# EAGLE design D1MiniTerminalBoard2Sided (EAGLE 7.6.0)
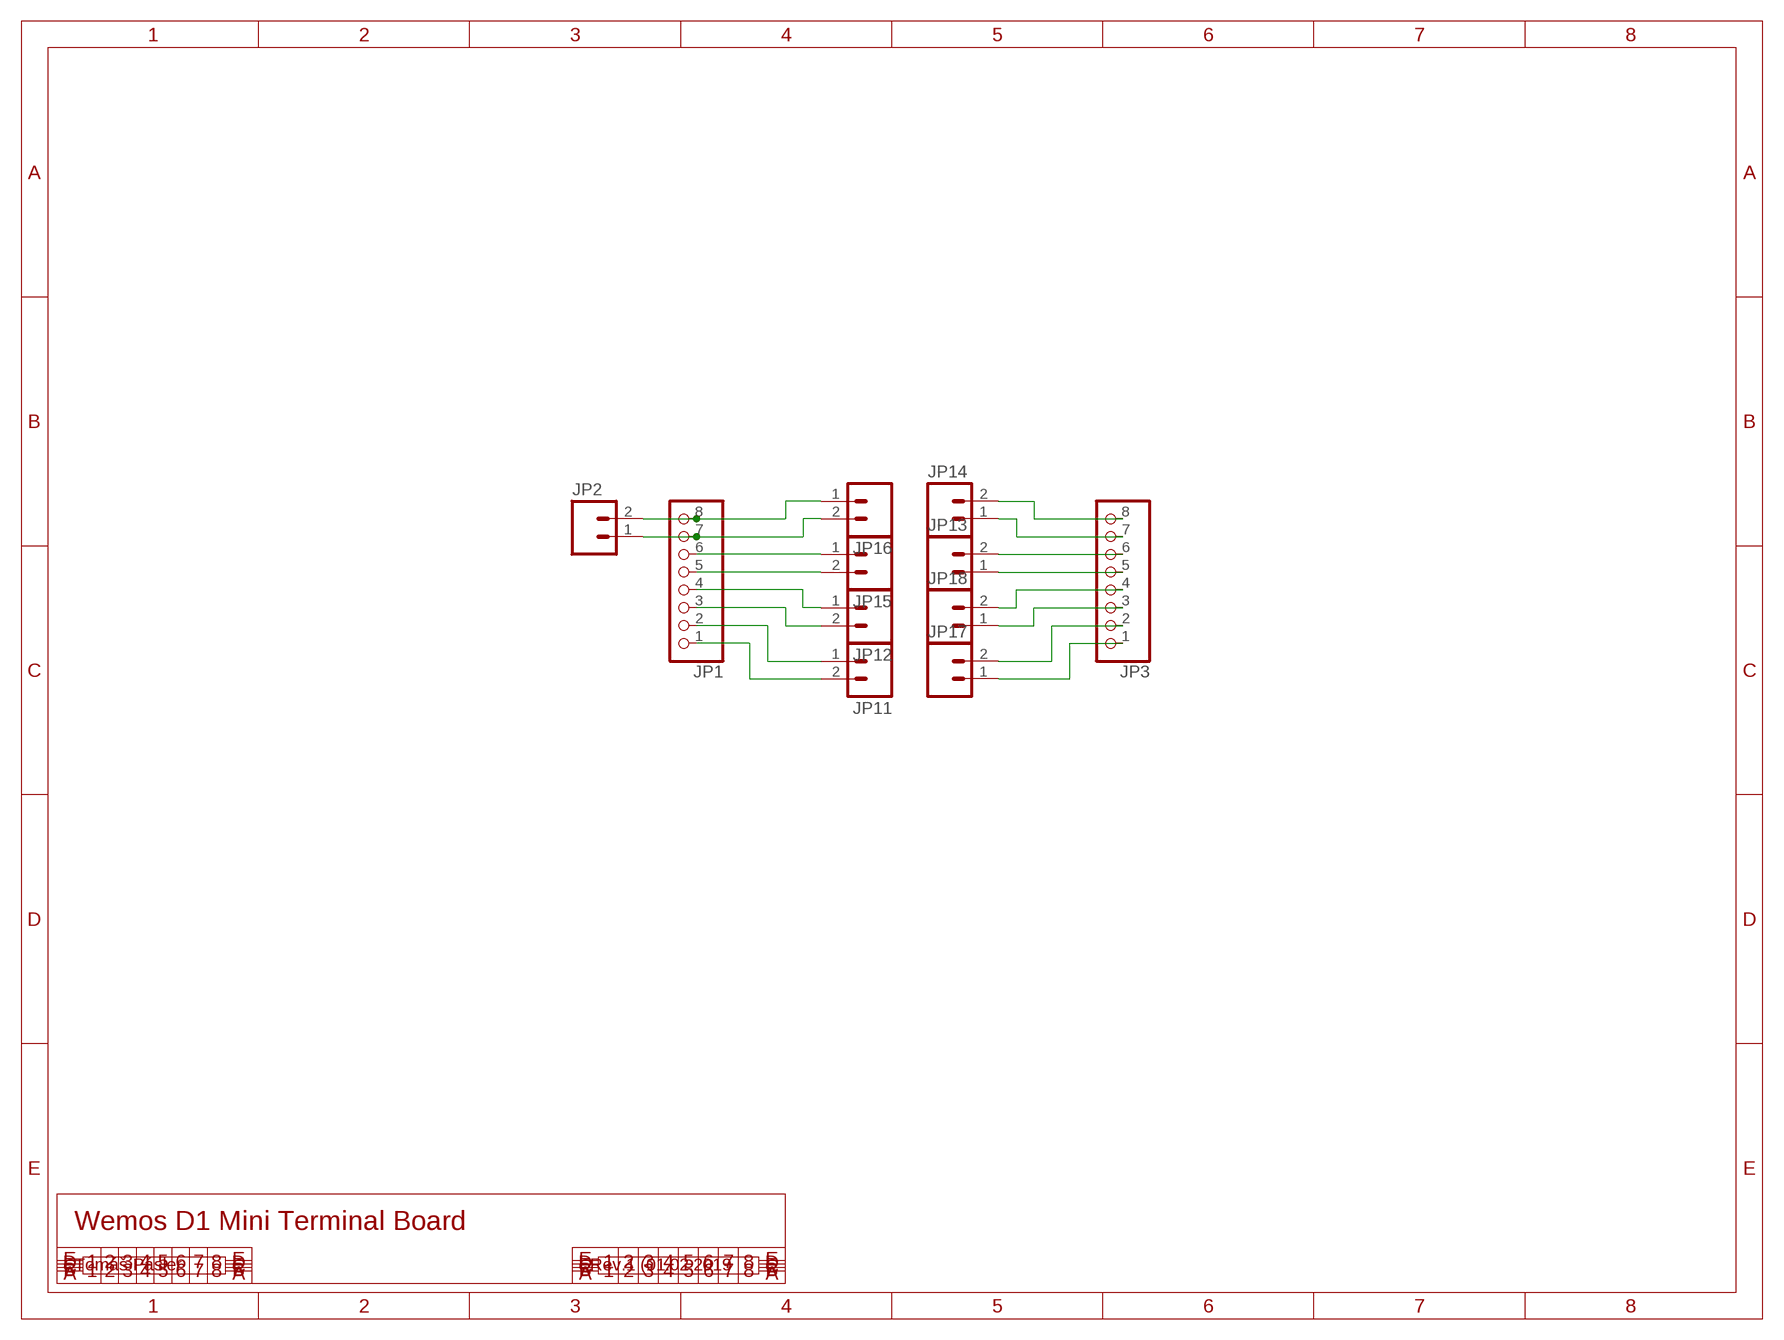
[diagram p0: schematic, sheet 1]

## Parts
JP1  PINHD-1X8  [1X08]
JP2  M023.5MM  [SCREWTERMINAL-3.5MM-2]
JP3  PINHD-1X8  [1X08]
JP11  M023.5MM  [SCREWTERMINAL-3.5MM-2]
JP12  M023.5MM  [SCREWTERMINAL-3.5MM-2]
JP13  M023.5MM  [SCREWTERMINAL-3.5MM-2]
JP14  M023.5MM  [SCREWTERMINAL-3.5MM-2]
JP15  M023.5MM  [SCREWTERMINAL-3.5MM-2]
JP16  M023.5MM  [SCREWTERMINAL-3.5MM-2]
JP17  M023.5MM  [SCREWTERMINAL-3.5MM-2]
JP18  M023.5MM  [SCREWTERMINAL-3.5MM-2]

## Nets
N$28: JP1.8 JP2.2 JP16.1
N$29: JP1.7 JP2.1 JP16.2
N$30: JP1.1 JP11.2
N$31: JP1.2 JP11.1
N$32: JP1.3 JP12.2
N$33: JP1.4 JP12.1
N$34: JP1.5 JP15.2
N$35: JP1.6 JP15.1
N$36: JP3.4 JP18.2
N$37: JP3.3 JP18.1
N$38: JP3.8 JP14.2
N$39: JP3.7 JP14.1
N$40: JP3.6 JP13.2
N$41: JP3.5 JP13.1
N$42: JP3.2 JP17.2
N$43: JP3.1 JP17.1

## Notes on the sheet
- Wemos D1 Mini Terminal Board
- Tomáš Pásler | Rev.1 (01.02.2019

## Library data of the parts
JP1 JP3 = pinhead:PINHD-1X8: PIN HEADER
JP2 JP11-JP18 = freetronics-jon:M02: Header 2 Standard 2-pin 0.1" header. Use with straight break away headers (SKU : PRT-00116), right angle break away headers (PRT-00553), swiss pins (PRT-00743), machine pins (PRT-00117), and female headers (PRT-00115). Molex polarized connector foot print use with SKU : PRT-08233 with associated crimp pins and housings.

## Net classes
0 default: width 0.203 mm, drill 0.356 mm, clearance 0.152 mm
1 power: width 0.203 mm, clearance 0.152 mm

## Board
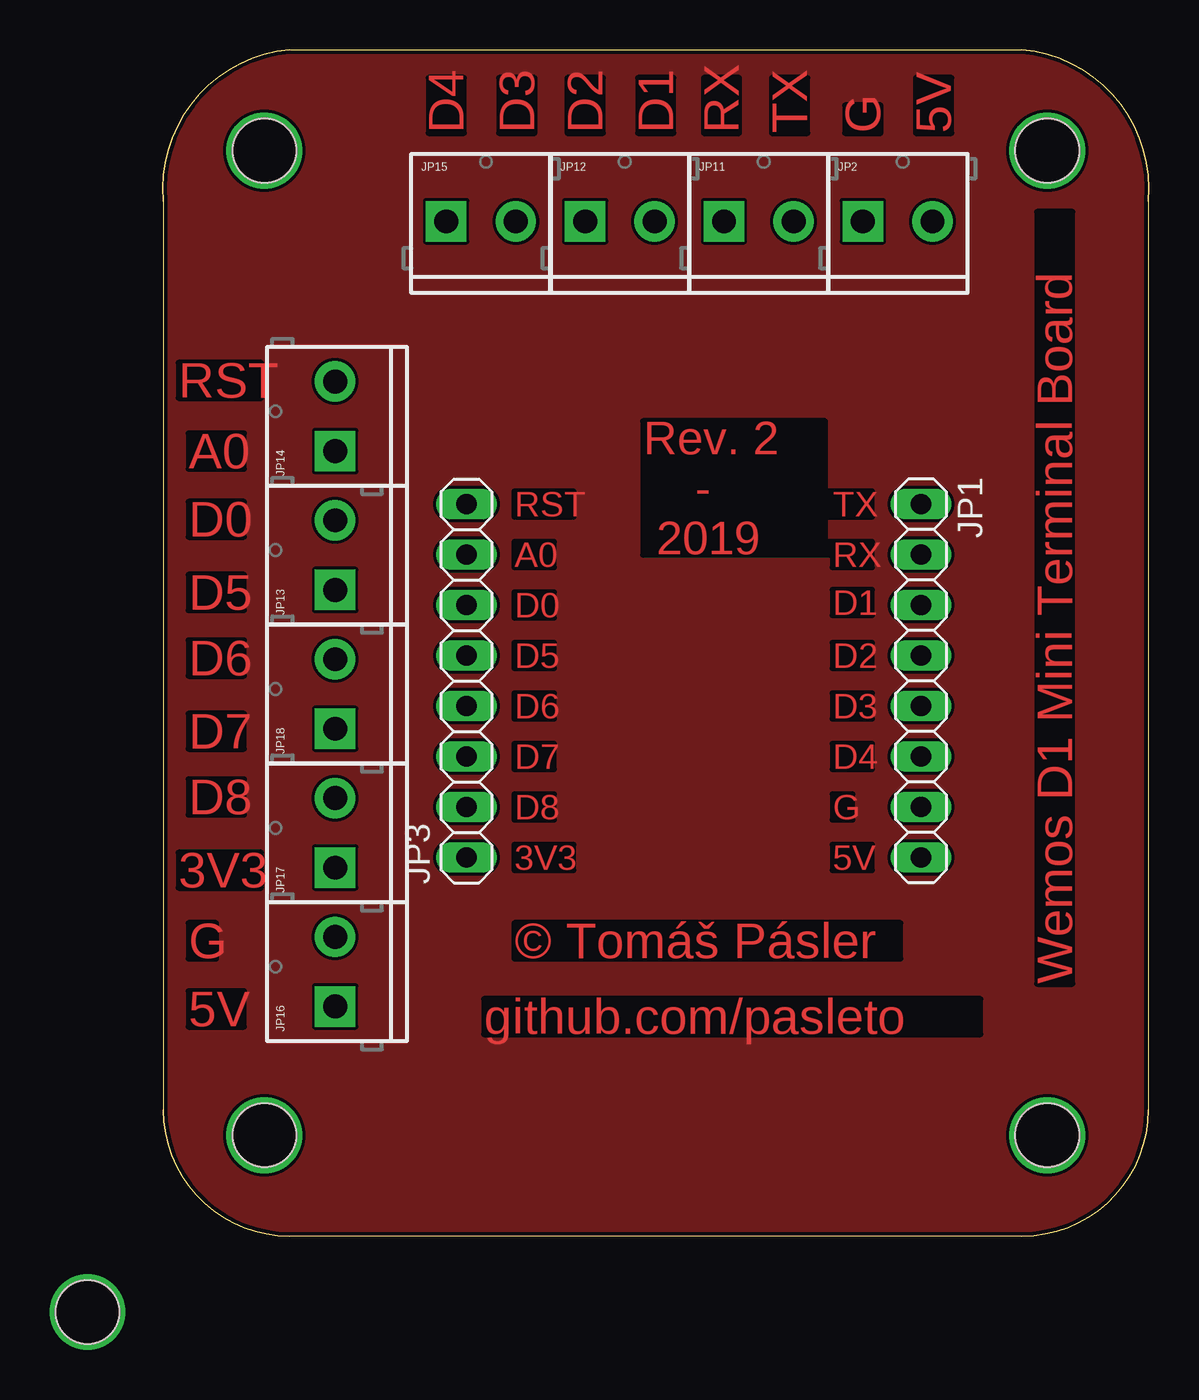
[diagram p1: board, top side]
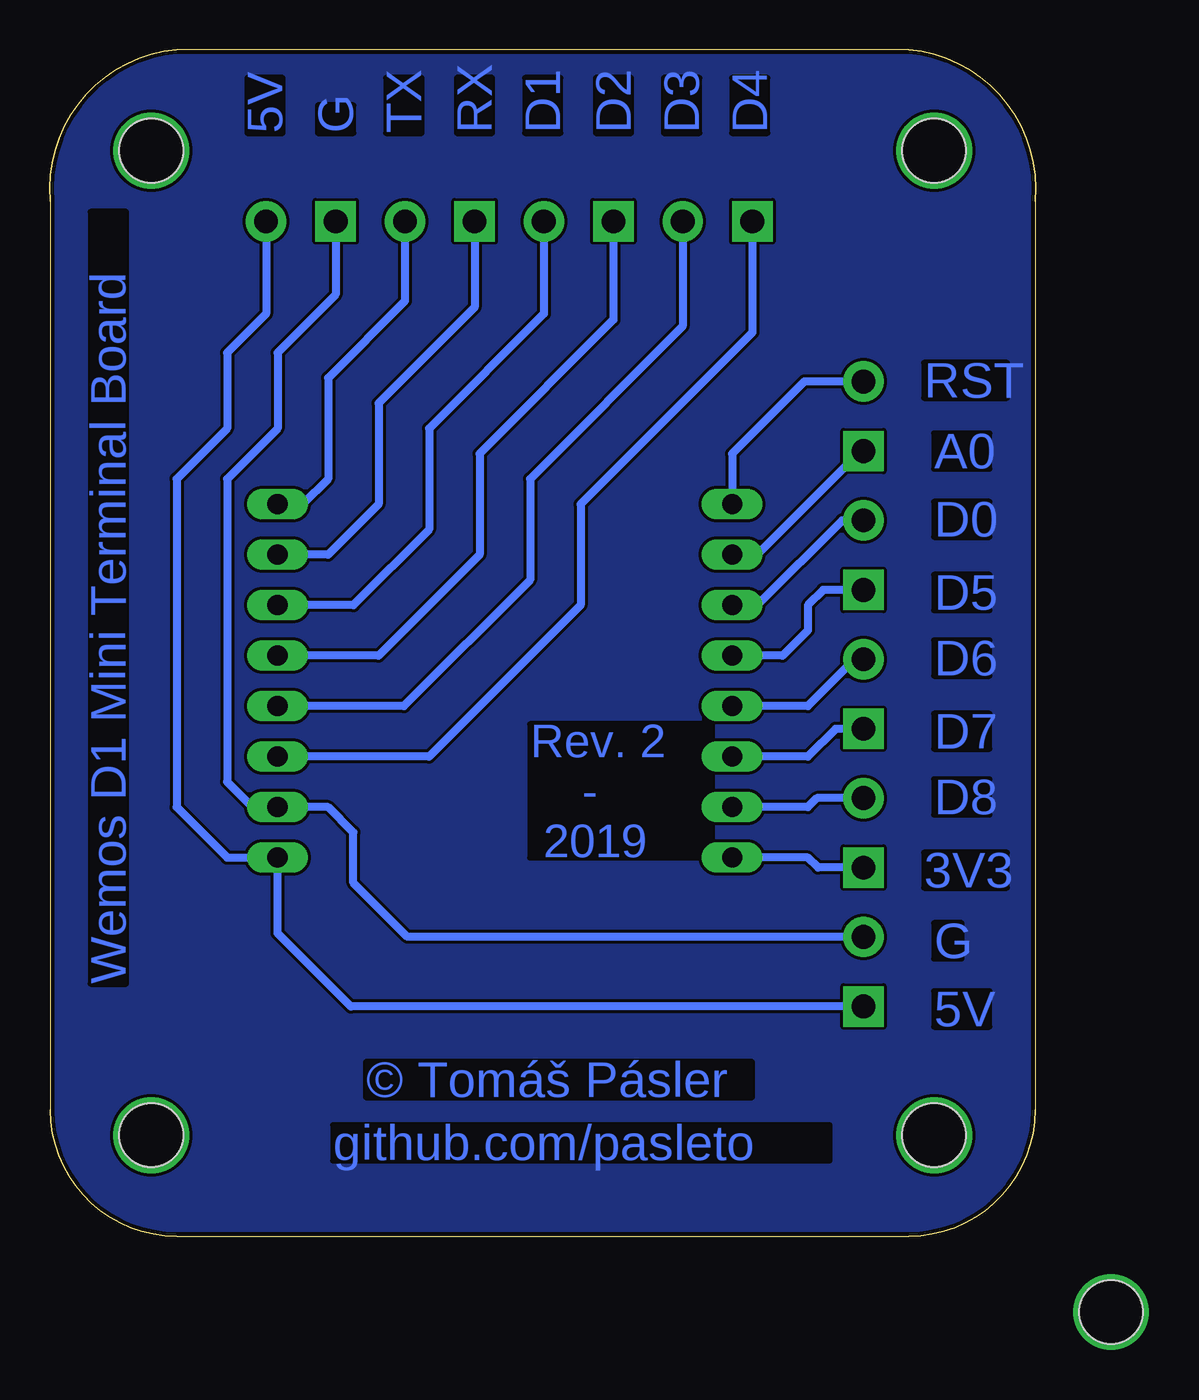
[diagram p2: board, bottom side, seen from below]

Size 49.59 x 59.69 mm. Coordinates in mm from the lower left corner, seen from the top.
Outline: 49.56,52.07 arc90 43.21,59.69
Outline: 6.38,59.69 arc90 0.03,52.07
Outline: 43.21,0 arc90 49.56,6.35
Outline: 0.03,6.35 arc90 6.38,0
Outline: 0.03,52.07 arc-90 6.38,59.69
Outline: 43.21,59.69 arc-90 49.56,52.07
Outline: 6.38,0 arc-90 0.03,6.35
Outline: 49.56,6.35 arc-90 43.21,0
Outline: 43.21,0 6.38,0
Outline: 49.56,52.07 arc90 43.21,59.69
Outline: 6.38,59.69 arc90 0.03,52.07
Outline: 43.21,0 arc90 49.56,6.35
Outline: 0.03,6.35 arc90 6.38,0
Outline: 49.56,52.07 49.56,6.35
Outline: 6.38,59.69 43.21,59.69
Outline: 0.03,52.07 0.03,6.35
Outline: 0.03,52.07 arc-90 6.38,59.69
Outline: 43.21,59.69 arc-90 49.56,52.07
Outline: 6.38,0 arc-90 0.03,6.35
Outline: 49.56,6.35 arc-90 43.21,0
Copper layers (1*16): Top 0.035mm / dielectric 1.5mm / Bottom 0.035mm
Design rules "ElectroDragon_2layer_DRU_no_angle_20140221": minimum track width 6mil, minimum drill 12mil, track to track 6mil, track to pad 6mil, pad to pad 6mil, via to via 6mil, smd to smd 6mil, copper to edge 8mil, drill to drill 6mil, minimum pad ring 10mil, minimum via ring 6mil, stop-mask expansion 4mil, vias tented up to drill 100mil, thermal gap 10mil
Holes 3.2 mm at 44.48,54.61 5.11,5.08 44.48,5.08 5.11,54.61 -3.78,-3.81

### Footprints (pad centres in the part's own frame; a part is rotated, then mirrored left to right if it is on the bottom)
1X08 = drill 1.016 long: 1 -8.89,0; 2 -6.35,0; 3 -3.81,0; 4 -1.27,0; 5 1.27,0; 6 3.81,0; 7 6.35,0; 8 8.89,0
SCREWTERMINAL-3.5MM-2 = drill 1.2 pad 2.032 square: 1 0,0 | drill 1.2 pad 2.032: 2 3.5,0

### Placement (x,y rotation side)
JP1  38.13,27.94 270 top
JP2  35.21,51.05 0 top
JP3  15.27,27.94 90 top
JP11  28.22,51.05 0 top
JP12  21.24,51.05 0 top
JP13  8.66,32.51 90 top
JP14  8.66,39.5 90 top
JP15  14.25,51.05 0 top
JP16  8.66,11.56 90 top
JP17  8.66,18.54 90 top
JP18  8.66,25.53 90 top

### Tracks (layer width: path | path; a pad name or v marks a point on that pad's centre or on a via)
GND
  pour Bottom: 0.03,6.35 0.03,52.07 arc-90 6.38,59.69 43.21,59.69 arc-90 49.56,52.07 49.56,5.84 arc-90 42.57,0 6.38,0 arc-90
GND2
  pour Top: 49.56,6.35 49.56,52.07 arc90 43.21,59.69 6.38,59.69 arc90 0.03,52.07 0.03,7.11 arc90 5.74,0 43.21,0 arc90
N$1  (via drill 1.2 pad 3.81)
  other vias: 5.11,5.08
N$2  (via drill 1.2 pad 3.81)
  other vias: 44.48,5.08
N$12  (via drill 1.2 pad 3.81)
  other vias: 5.11,54.61 -3.78,-3.81
N$28
  Bottom 0.406: JP16.1 34.45,11.56 38.13,15.24 JP1.8 40.67,19.05 43.21,21.59 43.21,38.1 40.67,40.64 40.67,44.45 38.71,46.41 JP2.2
N$29
  Bottom 0.406: JP16.2 31.6,15.06 34.32,17.78 34.32,20.32 35.59,21.59 JP1.7 39.4,21.59 40.67,22.86 40.67,38.1 38.13,40.64 38.13,44.45 35.21,47.37 JP2.1
N$30
  Bottom 0.406: JP11.2 31.72,47.05 35.59,43.18 35.59,38.1 36.86,36.83 JP1.1
N$31
  Bottom 0.406: JP11.1 28.22,46.74 33.05,41.91 33.05,36.83 35.59,34.29 JP1.2
N$32
  Bottom 0.406: JP12.2 24.74,46.41 30.51,40.64 30.51,35.56 34.32,31.75 JP1.3
N$33
  Bottom 0.406: JP12.1 21.24,46.1 27.97,39.37 27.97,34.29 33.05,29.21 JP1.4
N$34
  Bottom 0.406: JP15.2 17.75,45.78 25.43,38.1 25.43,33.02 31.78,26.67 JP1.5
N$35
  Bottom 0.406: JP15.1 14.25,45.47 22.89,36.83 22.89,31.75 30.51,24.13 JP1.6
N$36
  Bottom 0.406: JP18.2 9.1,29.03 11.46,26.67 JP3.4
N$37
  Bottom 0.406: JP18.1 10.06,25.53 11.46,24.13 JP3.3
N$38
  Bottom 0.406: JP14.2 11.64,43 15.27,39.37 JP3.8
N$39
  Bottom 0.406: JP14.1 8.79,39.5 14,34.29 JP3.7
N$40
  Bottom 0.406: JP13.2 9.74,36.01 14,31.75 JP3.6
N$41
  Bottom 0.406: JP13.1 10.7,32.51 11.46,31.75 11.46,30.48 12.73,29.21 JP3.5
N$42
  Bottom 0.406: JP17.2 11.01,22.04 11.46,21.59 JP3.2
N$43
  Bottom 0.406: JP17.1 10.95,18.54 11.46,19.05 JP3.1
N$56  (via drill 1.2 pad 3.81)
  other vias: 44.48,54.61

### Text on the board
Top: D4 | D3 | D2 | D1 | RX | TX | G | 5V | RST | A0 | RST | TX | D0 | Rev. 2 / - / 2019 | A0 | RX | D5 | D0 | D1 | D6 | D5 | D2 | D6 | D3 | D7 | D7 | D4 | D8 | D8 | G | 3V3 | 5V | 3V3 | G | © Tomáš Pásler | Wemos D1 Mini Terminal Board | 5V | github.com/pasleto
Bottom: D4 | D3 | D2 | D1 | RX | TX | G | 5V | RST | A0 | D0 | D5 | D6 | D7 | D8 | Rev. 2 / - / 2019 | 3V3 | G | Wemos D1 Mini Terminal Board | 5V | © Tomáš Pásler | github.com/pasleto